# EAGLE design sub_module (EAGLE 7.6.0)
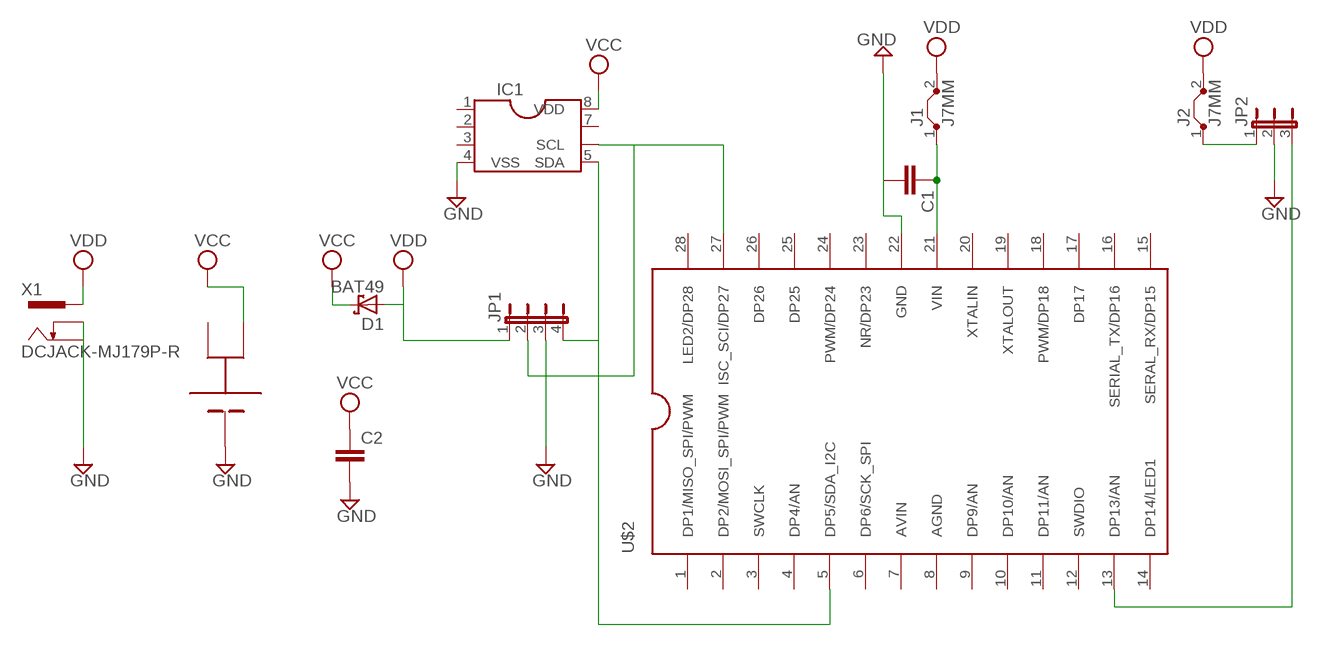
[diagram p0: schematic, sheet 1]

## Parts
C1  C-EUC2012  [C2012]
C2  C-EUC2012  [C2012]
D1  BAT49  [DO41-10]
IC1  DIL8S  [SOCKET-08]
J1  J7MM  [07]
J2  J7MM  [07]
JP1  JP4E  [JP4]
JP2  JP2E  [JP2]
U$1  CR2032-HOLDER  [CR2032-HOLDER]
U$2  LPC1114FDH28  [TSSOP28]
X1  DCJACK-MJ179P-R  [MJ-179P-R]

## Nets
GND: C1.2 C2.2 IC1.4(VSS) JP1.3 JP2.2 U$1.GND U$2.22(GND) X1.2 X1.3
N$1: IC1.6(SCL) JP1.2 U$2.27(ISC_SCI/DP27)
N$2: IC1.5(SDA) JP1.4 U$2.5(DP5/SDA_I2C)
N$3: C1.1 J1.1 U$2.21(VIN)
N$5: J2.1 JP2.1
N$6: JP2.3 U$2.13(DP13/AN)
VCC: C2.1 D1.C IC1.8(VDD) U$1.3VR
VDD: D1.A J1.2 J2.2 JP1.1 X1.1
Unconnected: IC1.1(CLKOE) IC1.2(CLKOUT) IC1.3(INT) IC1.7(V.C.) U$1.3VL U$2.1(DP1/MISO_SPI/PWM) U$2.2(DP2/MOSI_SPI/PWM) U$2.3(SWCLK) U$2.4(DP4/AN) U$2.6(DP6/SCK_SPI) U$2.9(DP9/AN) U$2.10(DP10/AN) U$2.11(DP11/AN) U$2.12(SWDIO) U$2.14(DP14/LED1) U$2.15(SERAL_RX/DP15) U$2.16(SERIAL_TX/DP16) U$2.17(DP17) U$2.18(PWM/DP18) U$2.19(XTALOUT) U$2.20(XTALIN) U$2.23(NR/DP23) U$2.24(PWM/DP24) U$2.25(DP25) U$2.26(DP26) U$2.28(LED2/DP28)

## Power pins joined to a net without a drawn wire
AGND: U$2.8(AGND)
AVIN: U$2.7(AVIN)

## Library data of the parts
C1 C2 = rcl:C-EU: CAPACITOR, European symbol
D1 = diode:BAT49: DIODE small signal diode
IC1 = RTC-module:DIL8: Dual In Line / Socket
J1 J2 = jumper:J: Bridge
JP1 = jumper:JP4E: JUMPER
JP2 = jumper:JP2E: JUMPER
U$1 = CR2032-holder:CR2032-HOLDER
U$2 = lpc1114fn28:LPC1114FDH28
X1 = dcjack:DCJACK: DC JACK 2.1mmφ - 5.5mmφ DCジャック、基板用。

## Board
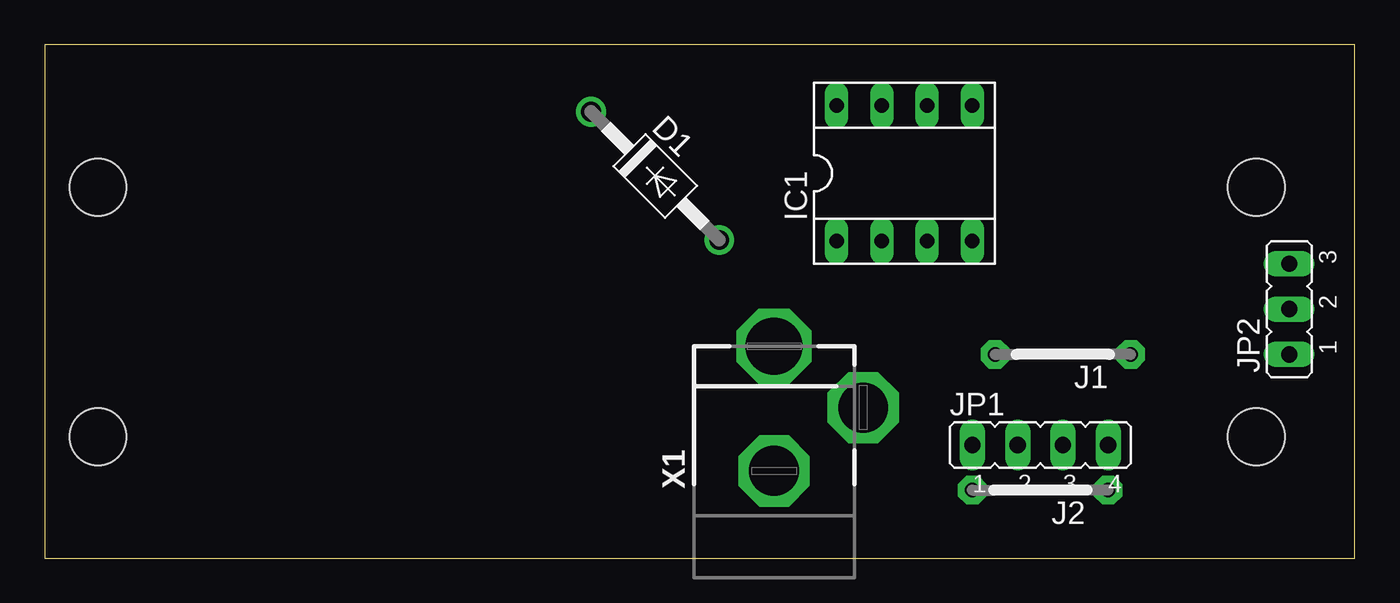
[diagram p1: board, top side]
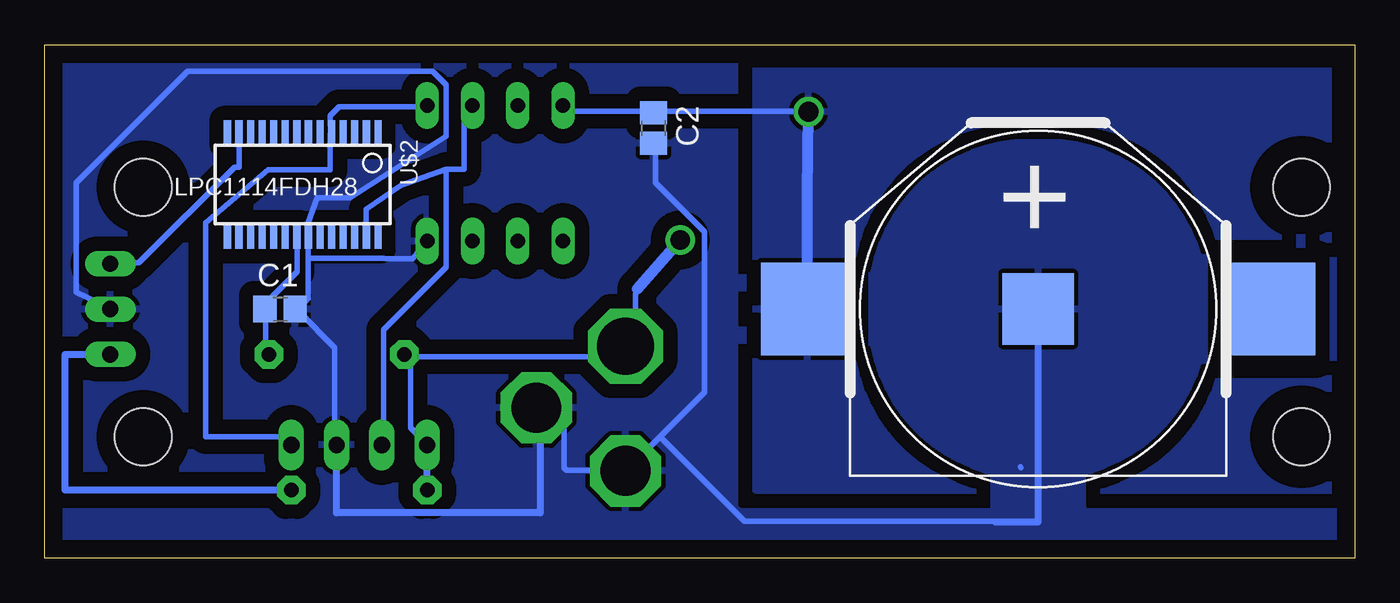
[diagram p2: board, bottom side, seen from below]

Size 73.54 x 28.81 mm. Coordinates in mm from the lower left corner, seen from the top.
Outline: 0,0 73.54,0 73.54,28.81 0,28.81 0,0
Copper layers (1*16): Top 0.035mm / dielectric 1.5mm / Bottom 0.035mm
Design rules "default *": minimum track width 0.3mm, minimum drill 24mil, track to track 0.2mm, track to pad 0.2mm, pad to pad 0.2mm, via to via 0.2mm, smd to smd 8mil, copper to edge 40mil, drill to drill 8mil, minimum pad ring 10mil, minimum via ring 8mil, stop-mask expansion 4mil, vias tented up to drill 0mil, thermal gap 10mil
Holes 3.2 mm at 3,6.81 68,20.81 3,20.81 68,6.81

### Footprints (pad centres in the part's own frame; a part is rotated, then mirrored left to right if it is on the bottom)
C2012 = smd 1.3 x 1.5: 1 -0.85,0; 2 0.85,0
DO41-10 = drill 1.118: A 5.08,0; C -5.08,0
SOCKET-08 = drill 0.813 long: 1 -3.81,-3.81; 2 -1.27,-3.81; 3 1.27,-3.81; 4 3.81,-3.81; 5 3.81,3.81; 6 1.27,3.81; 7 -1.27,3.81; 8 -3.81,3.81
07 = drill 0.813 pad 1.6 octagon: 1 -3.81,0; 2 3.81,0
JP4 = drill 0.914 long: 1 -3.81,0; 2 -1.27,0; 3 1.27,0; 4 3.81,0
JP2 = drill 0.914 long: 1 -2.54,0; 2 0,0; 3 2.54,0
CR2032-HOLDER = smd 5.2 x 5.2: 3VL -12.95,0; 3VR 12.95,0 | smd 4 x 4: GND 0,0
TSSOP28 = smd 0.4 x 1.35: 1 -4.225,-2.925; 2 -3.575,-2.925; 3 -2.925,-2.925; 4 -2.275,-2.925; 5 -1.625,-2.925; 6 -0.975,-2.925; 7 -0.325,-2.925; 8 0.325,-2.925; 9 0.975,-2.925; 10 1.625,-2.925; 11 2.275,-2.925; 12 2.925,-2.925; 13 3.575,-2.925; 14 4.225,-2.925; 15 4.225,2.925; 16 3.575,2.925; 17 2.925,2.925; 18 2.275,2.925; 19 1.625,2.925; 20 0.975,2.925; 21 0.325,2.925; 22 -0.325,2.925; 23 -0.975,2.925; 24 -1.625,2.925; 25 -2.275,2.925; 26 -2.925,2.925; 27 -3.575,2.925; 28 -4.225,2.925
MJ-179P-R = drill 3.2 pad 4 octagon: 1 3,0 | drill 2.8 pad 4 octagon: 2 -4,0; 3 -0.45,-5

### Placement (x,y rotation side)
C1  60.33,13.97 0 bottom
C2  39.37,24.13 270 bottom
D1  34.27,21.44 315 top
IC1  48.26,21.59 0 top
J1  57.15,11.43 180 top
J2  55.88,3.81 180 top
JP1  55.88,6.35 0 top
JP2  69.85,13.97 90 top
U$1  17.78,13.97 180 bottom
U$2  59.05,20.95 180 bottom
X1  40.94,8.89 90 top

### Tracks (layer width: path | path; a pad name or v marks a point on that pad's centre or on a via)
GND
  Bottom 0.3: X1.3 45.88,8.44 44.38,8.44 44.38,5.06 44.25,4.94 41,4.94 X1.2 40.75,5.06 39,6.81 | 39,6.81 36.5,9.31 36.5,18.31 39.25,21.06 39.25,23.06 C2.2 | 58.75,16.81 58.75,14.56 59.25,14.06 C1.2 59.25,13.81 57.25,11.81 57.25,6.56 JP1.3 | 58.75,16.81 58.75,17.81 U$2.22 58.75,18.06 58.75,18.81 58.25,20.2 56.38,20.2 51,23.67 51,26.56 51.75,27.31 65.5,27.31 71.75,21.06 71.75,14.92 70,14.06 JP2.2 | 58.75,16.81 54.5,16.81 54.38,16.8 52.88,16.8 IC1.4 | 20,2.06 34.25,2.06 39,6.81 | 18.75,5.06 18.77,5.14
  Bottom 0.406: X1.3 45.72,8.44 45.72,2.54 57.15,2.54 JP1.3 | 20.19,2.03 17.78,2.03 U$1.GND
  pour Bottom: 8.89,13.97 arc-90 17.78,22.86 arc-90 26.67,13.97 arc-90 17.78,5.08 arc-90
  pour Bottom (isolate 0.813, rank 4): 0.38,28.19 0.25,28.19 0.25,-0.13 73.15,-0.13 73.15,28.57
N$1
  Bottom 0.3: 51,21.81 50,21.81 50,25.31 IC1.6 | 51,21.81 53.52,20.92 55.5,19.57 55.5,18.31 U$2.27 | 51,21.81 51,16.31 54.5,12.81 54.5,6.81 JP1.2
N$2
  Bottom 0.3: IC1.5 52.5,25.31 57,25.31 57.5,24.81 57.5,24.31 U$2.5 57.5,23.81 57.5,21.79 61,21.79 64.5,18.8 64.5,6.81 60,6.81 JP1.4
N$3
  Bottom 0.3: U$2.21 59.38,17.93 59.38,16.06 61.12,14.31 61.12,14.06 C1.1 61.12,13.94 61.12,11.56 61,11.44 J1.1
N$5
  Bottom 0.406: J2.1 72.39,3.81 72.39,11.43 JP2.1
N$6
  Bottom 0.3: U$2.13 62.62,23.81 62.62,21.93 62.88,21.93 68.25,16.56 69.75,16.56 JP2.3
VCC
  Bottom 0.3: IC1.8 44.38,25.31 44.38,25.06 39.38,25.06 C2.1 39.25,25.06 30.88,25.06 D1.C
  Bottom 0.61: U$1.3VR 30.73,20.44 D1.C
  pour Bottom (isolate 1.27, rank 3): 0,28.57 33.66,28.57 33.66,3.81 0,3.81
VDD
  Bottom 0.3: JP1.1 52.5,6.81 53,7.31 53,11.31 J1.2 52.88,11.31 41.5,11.31 41,11.81 X1.1 40.88,11.94 40.38,11.94 40.38,14.81 40.28,15.09
  Bottom 0.406: J2.2 JP1.1
  Bottom 0.61: D1.A 40.28,15.09